# EAGLE design VacPack RevA (EAGLE 9.6.2)
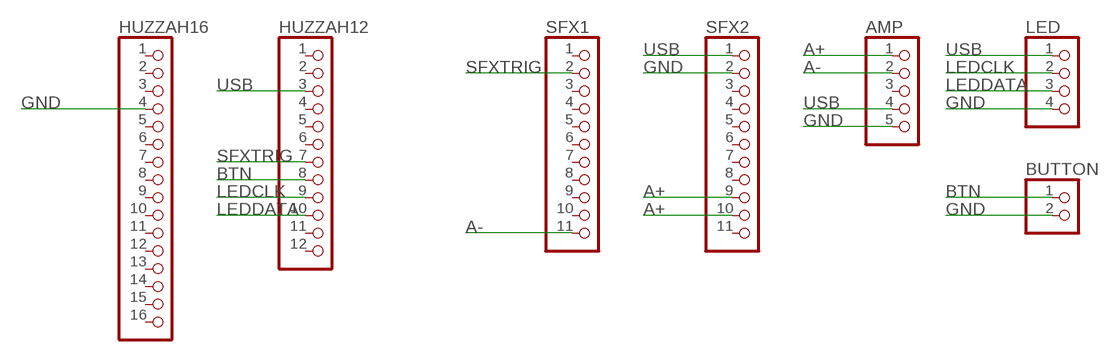
[diagram p0: schematic, sheet 1]

## Parts
AMP  PINHD-1X5  [1X05]
BUTTON  PINHD-1X2  [1X02]
HUZZAH12  PINHD-1X12  [1X12]
HUZZAH16  PINHD-1X16  [1X16]
LED  PINHD-1X4  [1X04]
SFX1  PINHD-1X11  [1X11]
SFX2  PINHD-1X11  [1X11]

## Nets
A+: AMP.1 SFX2.9 SFX2.10
A-: AMP.2 SFX1.11
BTN: BUTTON.1 HUZZAH12.8
GND [power]: AMP.5 BUTTON.2 HUZZAH16.4 LED.4 SFX2.2
LEDCLK: HUZZAH12.9 LED.2
LEDDATA: HUZZAH12.10 LED.3
SFXTRIG: HUZZAH12.7 SFX1.2
USB [power]: AMP.4 HUZZAH12.3 LED.1 SFX2.1
Unconnected: AMP.3 HUZZAH12.1 HUZZAH12.2 HUZZAH12.4 HUZZAH12.5 HUZZAH12.6 HUZZAH12.11 HUZZAH12.12 HUZZAH16.1 HUZZAH16.2 HUZZAH16.3 HUZZAH16.5 HUZZAH16.6 HUZZAH16.7 HUZZAH16.8 HUZZAH16.9 HUZZAH16.10 HUZZAH16.11 HUZZAH16.12 HUZZAH16.13 HUZZAH16.14 HUZZAH16.15 HUZZAH16.16 SFX1.1 SFX1.3 SFX1.4 SFX1.5 SFX1.6 SFX1.7 SFX1.8 SFX1.9 SFX1.10 SFX2.3 SFX2.4 SFX2.5 SFX2.6 SFX2.7 SFX2.8 SFX2.11

## Library data of the parts
AMP = pinhead:PINHD-1X5: PIN HEADER
BUTTON = pinhead:PINHD-1X2: PIN HEADER
HUZZAH12 = pinhead:PINHD-1X12: PIN HEADER
HUZZAH16 = pinhead:PINHD-1X16: PIN HEADER
LED = pinhead:PINHD-1X4: PIN HEADER
SFX1 SFX2 = pinhead:PINHD-1X11: PIN HEADER

## Net classes
1 power: width 0.635 mm

## Board
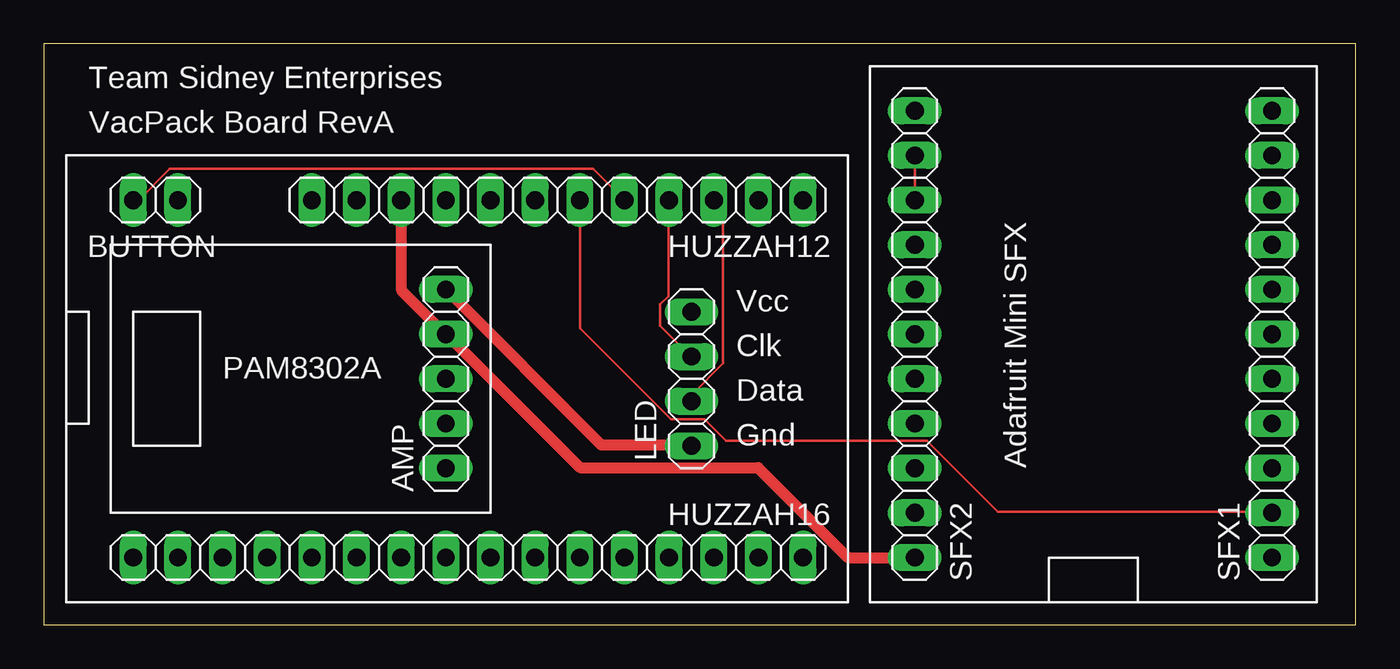
[diagram p1: board, top side]
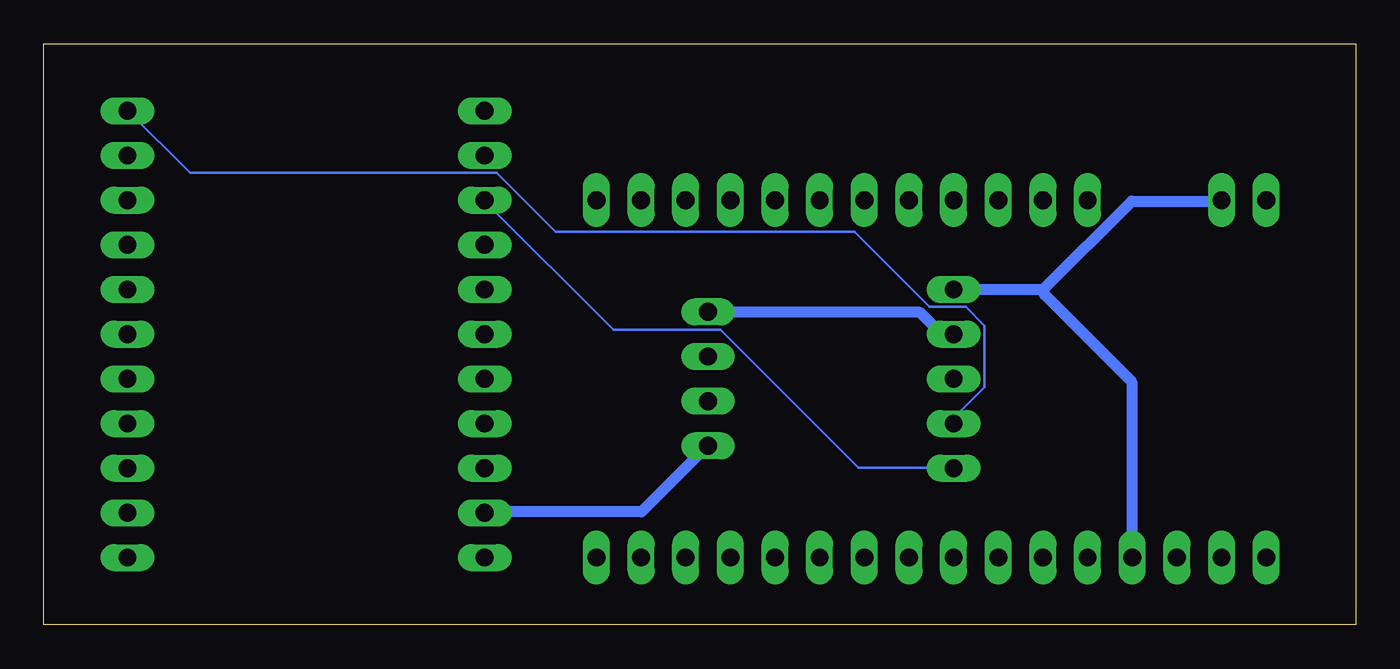
[diagram p2: board, bottom side, seen from below]

Size 74.6 x 33.01 mm. Coordinates in mm from the lower left corner, seen from the top.
Outline: 0,0 74.6,0 74.6,33.01 0,33.01 0,0
Copper layers (1*16): Top 0.035mm / dielectric 1.5mm / Bottom 0.035mm
Design rules "default": minimum track width 6mil, minimum drill 0.35mm, track to track 6mil, track to pad 6mil, pad to pad 6mil, via to via 6mil, smd to smd 6mil, copper to edge 40mil, drill to drill 6mil, minimum pad ring 10mil, minimum via ring 8mil, stop-mask expansion 4mil, vias tented up to drill 0mil, thermal gap 10mil

### Footprints (pad centres in the part's own frame; a part is rotated, then mirrored left to right if it is on the bottom)
1X05 = drill 1.016 long: 1 -5.08,0; 2 -2.54,0; 3 0,0; 4 2.54,0; 5 5.08,0
1X02 = drill 1.016 long: 1 -1.27,0; 2 1.27,0
1X12 = drill 1.016 long: 1 -13.97,0; 2 -11.43,0; 3 -8.89,0; 4 -6.35,0; 5 -3.81,0; 6 -1.27,0; 7 1.27,0; 8 3.81,0; 9 6.35,0; 10 8.89,0; 11 11.43,0; 12 13.97,0
1X16 = drill 1.016 long: 1 -19.05,0; 2 -16.51,0; 3 -13.97,0; 4 -11.43,0; 5 -8.89,0; 6 -6.35,0; 7 -3.81,0; 8 -1.27,0; 9 1.27,0; 10 3.81,0; 11 6.35,0; 12 8.89,0; 13 11.43,0; 14 13.97,0; 15 16.51,0; 16 19.05,0
1X04 = drill 1.016 long: 1 -3.81,0; 2 -1.27,0; 3 1.27,0; 4 3.81,0
1X11 = drill 1.016 long: 1 -12.7,0; 2 -10.16,0; 3 -7.62,0; 4 -5.08,0; 5 -2.54,0; 6 0,0; 7 2.54,0; 8 5.08,0; 9 7.62,0; 10 10.16,0; 11 12.7,0

### Placement (x,y rotation side)
AMP  22.86,13.97 90 top
BUTTON  6.35,24.13 0 top
HUZZAH12  29.21,24.13 0 top
HUZZAH16  24.13,3.81 0 top
LED  36.83,13.97 270 top
SFX1  69.85,16.51 90 top
SFX2  49.53,16.51 90 top

### Tracks (layer width: path | path; a pad name or v marks a point on that pad's centre or on a via)
A+
  Top 0.152: SFX2.9 SFX2.10
  Bottom 0.152: AMP.1 22.86,8.91 28.27,8.91 36.12,16.76 42.22,16.76 49.53,24.08 SFX2.9
A-
  Bottom 0.152: AMP.2 22.86,11.73 21.11,13.49 21.11,16.99 22.17,18.06 24.23,18.06 28.5,22.33 45.49,22.33 48.84,25.68 66.29,25.68 69.8,29.18 SFX1.11
BTN
  Top 0.152: HUZZAH12.8 31.24,25.91 7.16,25.91 5.41,24.16 5.11,24.16 BUTTON.1
GND
  Top 0.635: AMP.5 31.7,10.21 36.8,10.21 LED.4
  Bottom 0.635: SFX2.2 49.53,6.4 40.62,6.4 36.88,10.13 LED.4 | 17.75,19.05 12.72,24.08 7.62,24.08 BUTTON.2 | AMP.5 17.75,19.05 | HUZZAH16.4 12.72,3.81 12.72,13.79 17.68,18.75 17.75,19.05
LEDCLK
  Top 0.152: HUZZAH12.9 35.51,24.08 35.51,18.67 35.05,18.21 35.05,16.99 36.8,15.24 LED.2
LEDDATA
  Top 0.152: LED.3 36.88,12.72 36.88,13.11 38.63,14.86 38.63,23.55 38.1,24.08 HUZZAH12.10
SFXTRIG
  Top 0.152: HUZZAH12.7 30.48,16.84 35.66,11.66 37.57,11.66 38.79,10.44 50.22,10.44 54.25,6.4 69.8,6.4 SFX1.2
USB
  Top 0.635: SFX2.1 45.72,3.81 40.62,8.91 30.48,8.91 22.86,16.54 AMP.4 22.63,16.69 20.34,18.97 20.34,24.08 HUZZAH12.3
  Bottom 0.635: LED.1 36.8,17.75 24.77,17.75 23.55,16.54 22.86,16.54 AMP.4

### Text on the board
tNames: Team Sidney Enterprises | VacPack Board RevA | Vcc | Clk | PAM8302A | Data | Gnd | Adafruit Mini SFX